# EAGLE schematic TCM320 (EAGLE 7.5.0)
CNAME: TCM320 schematic; CREVISION: 1.0; DESIGNER: handco
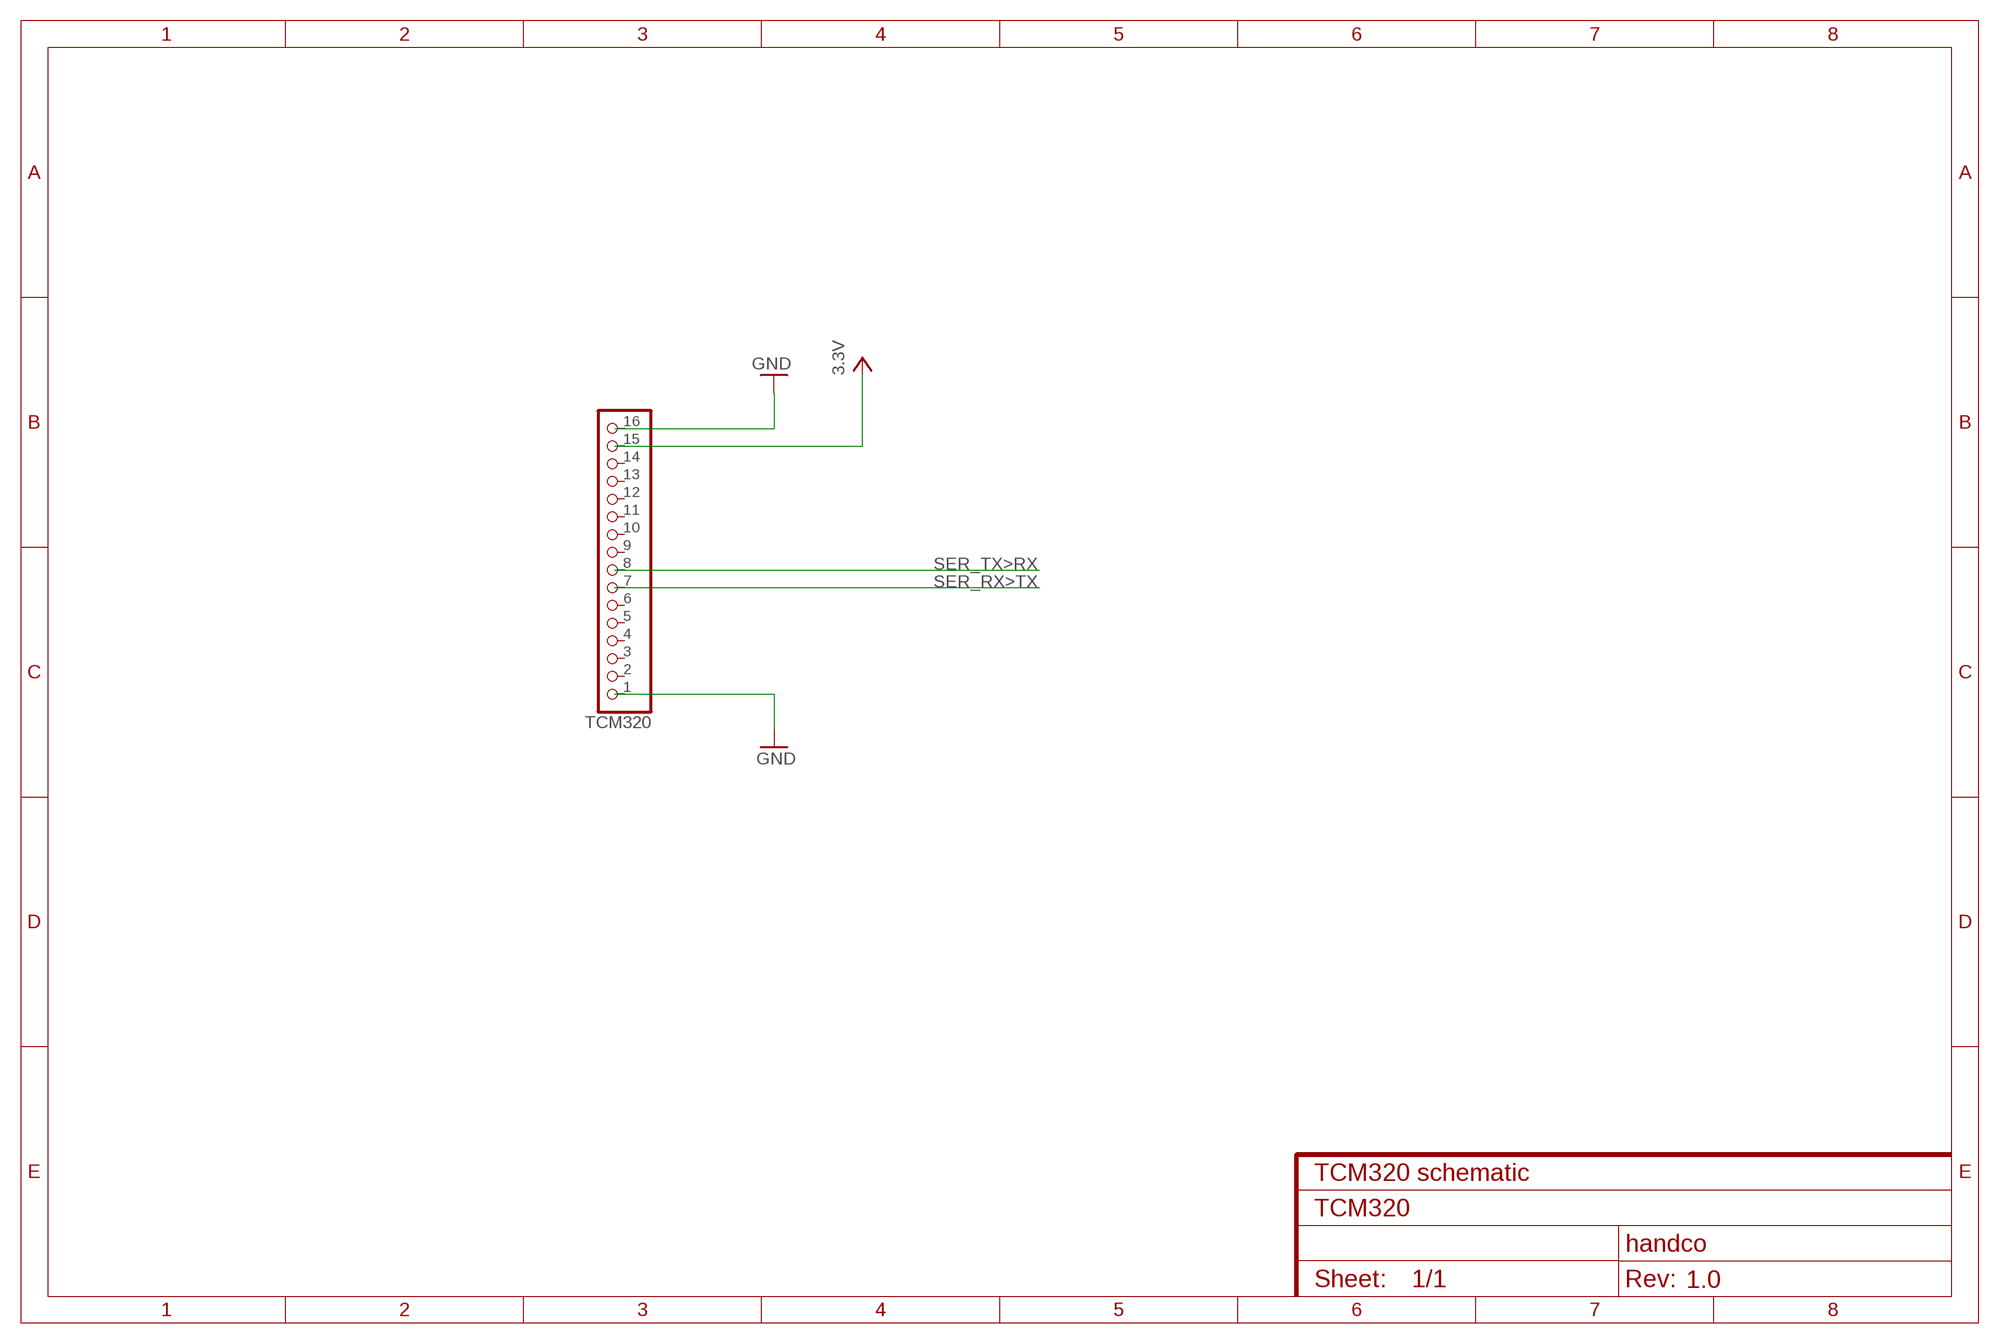
[diagram p0: schematic, sheet 1]

## Parts
TCM320  PINHD-1X16  [1X16]
Unconnected: TCM320.1 TCM320.2 TCM320.3 TCM320.4 TCM320.5 TCM320.6 TCM320.7 TCM320.8 TCM320.9 TCM320.10 TCM320.11 TCM320.12 TCM320.13 TCM320.14 TCM320.15 TCM320.16

## Library data of the parts
TCM320 = pinhead:PINHD-1X16: PIN HEADER